# Altium schematic sheet 平衡车双声20717.SchDoc
size A3
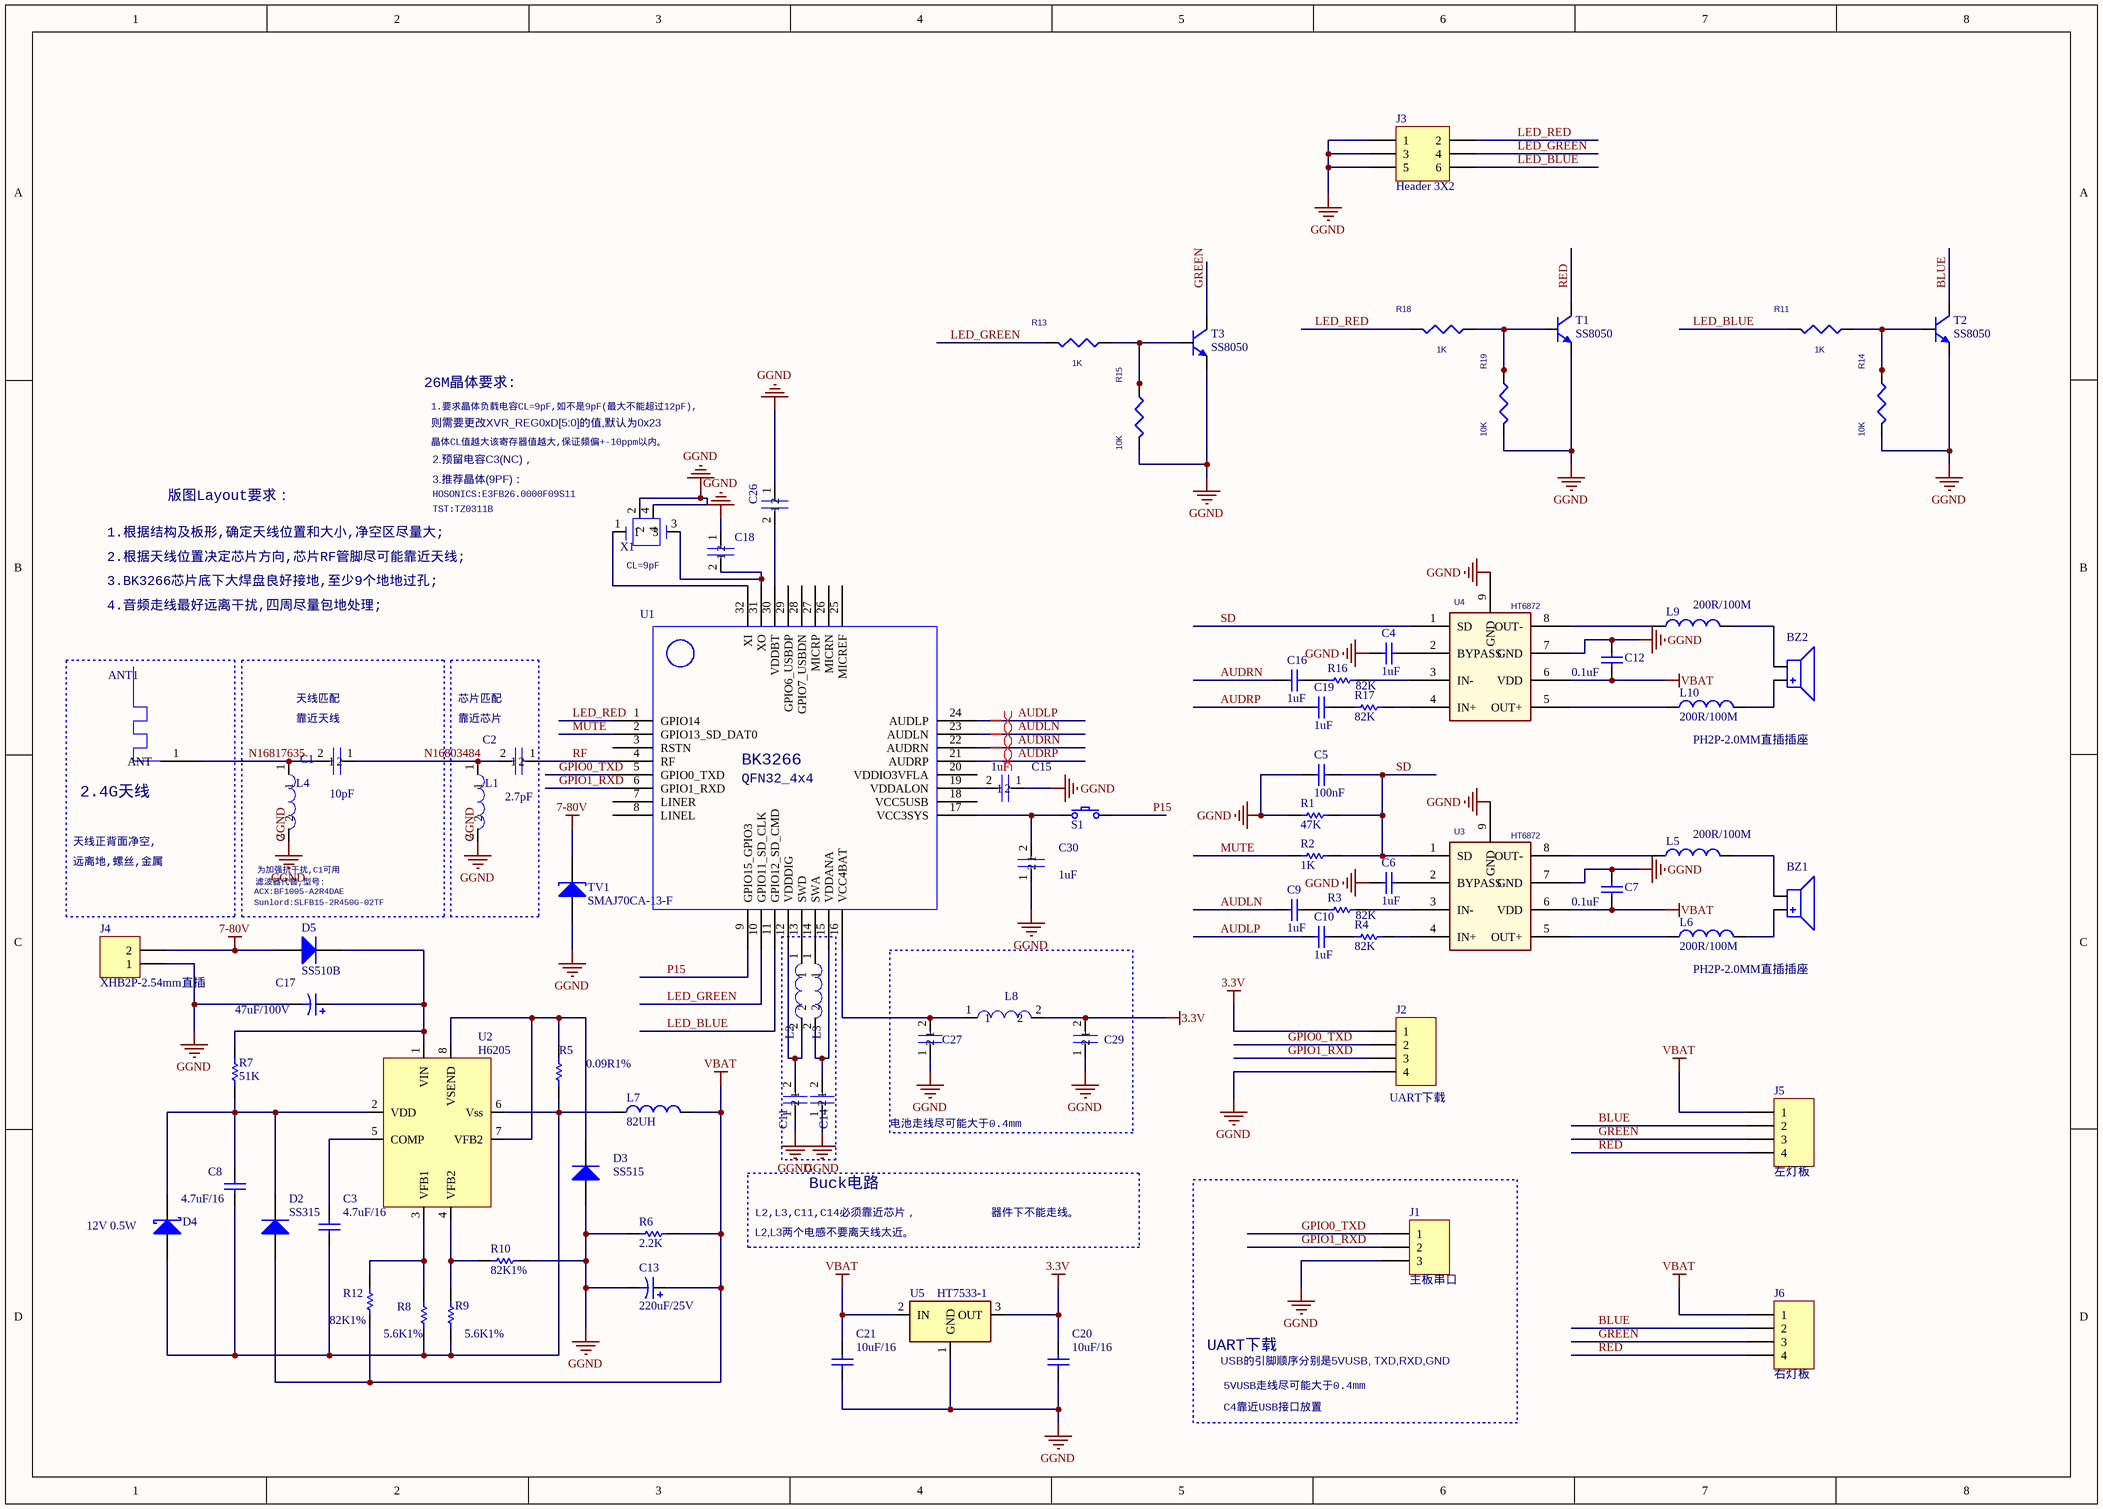
[diagram p0: 平衡车双声20717.SchDoc]

## Parts
ANT1  ANT_2G4  [BT_NAMI_2]  (value not drawn)
BZ1  PH2P-2.0MM直插插座  [2PIN-2.0]
BZ2  PH2P-2.0MM直插插座  [2PIN-2.0]
C1  10pF  [LC-0603_C]
C2  2.7pF  [LC-0603_C]
C3  4.7uF/16  [LC-0805_C]
C4  1uF  [LC-0603_C]
C5  100nF  [LC-0603_C]
C6  1uF  [LC-0603_C]
C7  0.1uF  [LC-0603_C]
C8  4.7uF/16  [LC-0805_C]
C9  1uF  [LC-0603_C]
C10  1uF  [LC-0603_C]
C11  4.7uF/0603  [LC-0603_C]  (value not drawn)
C12  0.1uF  [LC-0603_C]
C13  220uF/25V  [R3.5/8]
C14  4.7uF/0603  [LC-0603_C]  (value not drawn)
C15  1uF  [LC-0603_C]
C16  1uF  [LC-0603_C]
C17  47uF/100V  [R3.5/8_1]
C18  10pF  [LC-0603_C]  (value not drawn)
C19  1uF  [LC-0603_C]
C20  10uF/16  [LC-0805_C]
C21  10uF/16  [LC-0805_C]
C26  1uF  [LC-0603_C]  (value not drawn)
C27  0.1uF  [LC-0603_C]  (value not drawn)
C29  0.1uF  [LC-0603_C]  (value not drawn)
C30  1uF  [LC-0603_C]
D2  SS315  [DO-214AA]
D3  SS515  [DO-214AA]
D4  12V 0.5W  [LL34/SOD-80]
D5  SS510B  [DO-214AA]
J1  主板串口  [3PIN-2.0]
J2  UART下载  [4P-2.0]
J3  Header 3X2  [3P*2-2.0]
J4  XHB2P-2.54mm直插  [2P-2.5]
J5  左灯板  [4PIN-2.0]
J6  右灯板  [4PIN-2.0]
L1  NC  [LC-0603_L]  (value not drawn)
L2  INDUCTOR_3NH_0603_1  [0805L]  (value not drawn)
L3  INDUCTOR_3NH_0603_1  [0805L]  (value not drawn)
L4  NC  [LC-0603_L]  (value not drawn)
L5  200R/100M  [LC-0603_L]
L6  200R/100M  [LC-0603_L]
L7  82UH  [CD104]
L8  INDUCTOR_3NH_0603_1  [0805L]  (value not drawn)
L9  200R/100M  [LC-0603_L]
L10  200R/100M  [LC-0603_L]
R1  47K  [LC-0603_R]
R2  1K  [LC-0603_R]
R3  82K  [LC-0603_R]
R4  82K  [LC-0603_R]
R5  0.09R1%  [LC-1206_R]
R6  2.2K  [LC-0603_R]
R7  51K  [LC-0603_R]
R8  5.6K1%  [LC-0603_R]
R9  5.6K1%  [LC-0603_R]
R10  82K1%  [LC-0603_R]
R11  1K  [LC-0603_R]
R12  82K1%  [LC-0603_R]
R13  1K  [LC-0603_R]
R14  10K  [LC-0603_R]
R15  10K  [LC-0603_R]
R16  82K  [LC-0603_R]
R17  82K  [LC-0603_R]
R18  1K  [LC-0603_R]
R19  10K  [LC-0603_R]
S1  SW  [KEY_5.2*3.7*6.4]  (value not drawn)
T1  SS8050  [SOT-23-3L]
T2  SS8050  [SOT-23-3L]
T3  SS8050  [SOT-23-3L]
TV1  SMAJ70CA-13-F  [DO-214AA]
U1  BK3266_QFN32_5  [QFN32_4*4*0.4]  (value not drawn)
U2  H6205  [ESOP8]
U3  HT6872  [SOP8-LW]
U4  HT6872  [SOP8-LW]
U5  HT7533-1  [SOT-89-3]
X1  XTAL_16MHZ  [XTAL3225]  (value not drawn)

## Blocks framed on the sheet
2.4G天线: ANT1
电池走线尽可能大于0.4mm: C27 C29 L8
UART下载: J1

## Nets
3.3V: C20.2 C29.2 J2.1 L8.2 U5.3(OUT)
7-80V: D5.1(A) J4.2 TV1.2(K)
GGND: C4.1 C5.1 C6.1 C7.2 C11.1 C12.2 C13.2 C14.1 C15.1 C17.2 C18.1 C20.1 C21.1 C26.1 C27.1 C29.1 C30.1 D3.1(A) J1.3 J2.4 J3.1 J3.3 J3.5 J4.1 L1.2 L4.2 R1.1 R6.2 R10.2 R14.2 R15.2 R19.2 T1.2 T2.2 T3.2 TV1.1(A) U1.33(GGND) U3.7(GND) U3.9(GND) U4.7(GND) U4.9(GND) U5.1(GND) X1.2 X1.4
VBAT: C7.1 C12.1 C13.1 C21.2 D2.1(A) J5.1 J6.1 L7.2 R6.1 R12.1 U3.6(VDD) U4.6(VDD) U5.2(IN)
AUDLN: C9.1 U1.23(AUDLN)
AUDLP: C10.1 U1.24(AUDLP)
AUDRN: C16.1 U1.22(AUDRN)
AUDRP: C19.1 U1.21(AUDRP)
BLUE: J5.2 J6.2 T2.3
GPIO0_TXD: J1.1 J2.2 U1.5(GPIO0_TXD)
GPIO1_RXD: J1.2 J2.3 U1.6(GPIO1_RXD)
GREEN: J5.3 J6.3 T3.3
LED_BLUE: J3.6 R11.2 U1.11(GPIO12_SD_CMD)
LED_GREEN: J3.4 R13.2 U1.10(GPIO11_SD_CLK)
LED_RED: J3.2 R18.2 U1.1(GPIO14)
MUTE: R2.1 U1.2(GPIO13_SD_DAT0)
N16803484: C1.1 C2.2 L1.1
N16817635: ANT1.1(ANT) C1.2 L4.1
P15: S1.2 U1.9(GPIO15_GPIO3)
RED: J5.4 J6.4 T1.3
RF: C2.1 U1.4(RF)
SD: C5.2 R1.2 R2.2 U3.1(SD) U4.1(SD)
NetBZ1_1: BZ1.1 L6.2
NetBZ1_2: BZ1.2 L5.2
NetBZ2_1: BZ2.1 L10.2
NetBZ2_2: BZ2.2 L9.2
NetC3_1: C3.1 C8.1 D4.1(A) L7.1 R5.1 R8.2 R9.2 U2.6(Vss)
NetC3_2: C3.2 U2.5(COMP)
NetC4_2: C4.2 U4.2(BYPASS)
NetC6_2: C6.2 U3.2(BYPASS)
NetC8_2: C8.2 D2.2(K) D4.2(K) R7.1 U2.2(VDD)
NetC9_2: C9.2 R3.1
NetC10_2: C10.2 R4.1
NetC11_2: C11.2 L2.2 U1.12(VDDDIG)
NetC14_2: C14.2 L3.2 U1.15(VDDANA)
NetC15_2: C15.2 U1.19(VDDALON)
NetC16_2: C16.2 R16.1
NetC17_1: C17.1 D5.2(K) R7.2 U2.1(VIN)
NetC18_2: C18.2 U1.31(XO) X1.3
NetC19_2: C19.2 R17.1
NetC26_2: C26.2 U1.30(VDDBT)
NetC27_2: C27.2 L8.1 U1.16(VCC4BAT)
NetC30_2: C30.2 S1.1 U1.17(VCC3SYS)
NetD3_2: D3.2(K) R5.2 U2.7(VFB2) U2.8(VSEND)
NetL2_1: L2.1 U1.13(SWD)
NetL3_1: L3.1 U1.14(SWA)
NetL5_1: L5.1 U3.8(OUT-)
NetL6_1: L6.1 U3.5(OUT+)
NetL9_1: L9.1 U4.8(OUT-)
NetL10_1: L10.1 U4.5(OUT+)
NetR3_2: R3.2 U3.3(IN-)
NetR4_2: R4.2 U3.4(IN+)
NetR8_1: R8.1 R12.2 U2.3(VFB1)
NetR9_1: R9.1 R10.1 U2.4(VFB2)
NetR11_1: R11.1 R14.1 T2.1
NetR13_1: R13.1 R15.1 T3.1
NetR16_2: R16.2 U4.3(IN-)
NetR17_2: R17.2 U4.4(IN+)
NetR18_1: R18.1 R19.1 T1.1
NetU1_32: U1.32(XI) X1.1

Not connected (* = marked no-connect by the designer): U1 3(RSTN) 7(LINER) 8(LINEL) 18(VCC5USB) 20(VDDIO3VFLA) 25(MICREF) 26(MICRN) 27(MICRP) 28(GPIO7_USBDN) 29(GPIO6_USBDP)

## Layout directives
differential pair: AUDLN, AUDLP, AUDRN, AUDRP

## Notes on the sheet
- 26M晶体要求:
- 1.要求晶体负载电容CL=9pF,如不是9pF(最大不能超过12pF),
- 则需要更改XVR_REG0xD[5:0]的值,默认为0x23
- 晶体CL值越大该寄存器值越大,保证频偏+-10ppm以内。
- 版图Layout要求：
- 3.推荐晶体(9PF)：
- HOSONICS:E3FB26.0000F09S11
- TST:TZ0311B
- 2.预留电容C3(NC)，
- 1.根据结构及板形,确定天线位置和大小,净空区尽量大;
- 2.根据天线位置决定芯片方向,芯片RF管脚尽可能靠近天线;
- 3.BK3266芯片底下大焊盘良好接地,至少9个地地过孔;
- (near X1) CL=9pF
- 4.音频走线最好远离干扰,四周尽量包地处理;
- 天线匹配
- 靠近天线
- 芯片匹配
- 靠近芯片
- (near U1) BK3266
- (near U1) QFN32_4x4
- 天线正背面净空,
- 远离地,螺丝,金属
- ACX:BF1005-A2R4DAE
- (near D5) Sunlord:SLFB15-2R450G-02TF
- 滤波器代替,型号:
- (near L4) 为加强抗干扰,C1可用
- Buck电路
- L2,L3,C11,C14必须靠近芯片，
- L2,L3两个电感不要离天线太近。
- 器件下不能走线。
- USB的引脚顺序分别是5VUSB, TXD,RXD,GND
- 5VUSB走线尽可能大于0.4mm
- C4靠近USB接口放置

## Library data of the parts
ANT1 = ANT_2G4: PCB DECAL: PAD1.2CA; Source_Path: E:\LIB\BEKEN_WYF.OLB; Value: ANT_2G4
BZ1 BZ2 = BUZZER
C1 = C0603_1: Manufacturer: AVX; Manufacturer_Part_Number: 0805ZC105KAT2A; PCB DECAL: 0402R; Source_Path: D:\VSS60\PRODUCT DEVELOPMENT\BK3266\BK3266 APPLICATION\DESIGN KIT\WORKING DIRECTORY\V0.1\硬件参考\耳机参考设计_QFN32_4X4\SCH-BK3266_HEADSET_REFERENCE_DESIGN_QFN32_4X4_V1.DSN; Value: 10pF/BPF; APN: C071-0
C2 C15 C26 C30 = C0603_1: Manufacturer: AVX; Manufacturer_Part_Number: 0805ZC105KAT2A; PCB DECAL: 0402R; Source_Path: D:\VSS60\PRODUCT DEVELOPMENT\BK3266\BK3266 APPLICATION\DESIGN KIT\WORKING DIRECTORY\V0.1\硬件参考\耳机参考设计_QFN32_4X4\SCH-BK3266_HEADSET_REFERENCE_DESIGN_QFN32_4X4_V1.DSN; APN: C071-0
  C2: Value: 2.7pF
  C15 C26 C30: Value: 1uF
C3 C8 C20 C21 = Cap: Capacitor; Value: 100pF; Published: 8-Jun-2000; LatestRevisionDate: 17-Jul-2002; LatestRevisionNote: Re-released for DXP Platform.; PackageReference: RAD-0.3; Publisher: Altium Limited
C4 C6 C9 C10 C16 C19 = Cap: Capacitor; Value: 100NF; Published: 8-Jun-2000; LatestRevisionDate: 17-Jul-2002; LatestRevisionNote: Re-released for DXP Platform.; PackageReference: RAD-0.3; Publisher: Altium Limited
C5 = Cap: Capacitor; Published: 8-Jun-2000; LatestRevisionDate: 17-Jul-2002; LatestRevisionNote: Re-released for DXP Platform.; PackageReference: RAD-0.3; Publisher: Altium Limited; Value: 100NF
C7 C12 = Cap: Capacitor; Value: 2.7PF; Published: 8-Jun-2000; LatestRevisionDate: 17-Jul-2002; LatestRevisionNote: Re-released for DXP Platform.; PackageReference: RAD-0.3; Publisher: Altium Limited
C11 C14 = AVX__1.01_UF_0603: Manufacturer: AVX; Manufacturer_Part_Number: 06035C103KAt2A; PCB DECAL: 0402R; Source_Path: D:\VSS60\PRODUCT DEVELOPMENT\BK3266\BK3266 APPLICATION\DESIGN KIT\WORKING DIRECTORY\V0.1\硬件参考\耳机参考设计_QFN32_4X4\SCH-BK3266_HEADSET_REFERENCE_DESIGN_QFN32_4X4_V1.DSN; Value: 2.2uF; APN: C006-0
C13 C17 = Cap Pol1: Polarized Capacitor (Radial); Value: 100pF; Published: 8-Jun-2000; LatestRevisionDate: 17-Jul-2002; LatestRevisionNote: Re-released for DXP Platform.; PackageReference: RB7.6-15; Publisher: Altium Limited
C18 = C0603_1: Manufacturer: AVX; Manufacturer_Part_Number: 0805ZC105KAT2A; PCB DECAL: 0402R; Source_Path: D:\VSS60\PRODUCT DEVELOPMENT\BK3266\BK3266 APPLICATION\DESIGN KIT\WORKING DIRECTORY\V0.1\硬件参考\耳机参考设计_QFN32_4X4\SCH-BK3266_HEADSET_REFERENCE_DESIGN_QFN32_4X4_V1.DSN; Value: NC; APN: C071-0
C27 C29 = AVX__1.01_UF_0603: Manufacturer: AVX; Manufacturer_Part_Number: 06035C103KAt2A; PCB DECAL: 0402R; Source_Path: D:\VSS60\PRODUCT DEVELOPMENT\BK3266\BK3266 APPLICATION\DESIGN KIT\WORKING DIRECTORY\V0.1\硬件参考\耳机参考设计_QFN32_4X4\SCH-BK3266_HEADSET_REFERENCE_DESIGN_QFN32_4X4_V1.DSN; Value: 4.7uF; APN: C006-0
D2 D3 D5 = Diode 1N5402: 3 Amp General Purpose Rectifier; Published: 8-Jun-2000; LatestRevisionDate: 17-Jul-2002; LatestRevisionNote: Re-released for DXP Platform.; DatasheetDocument: 1998; PackageDocument: Aug-1999; PackageReference: DO-201AD; Publisher: Altium Limited; ComponentLink1Description: Manufacturer Link; ComponentLink1URL: http://www.fairchildsemi.com/; ComponentLink2Description: Datasheet; ComponentLink2URL: http://www.fairchildsemi.com/ds/1N%2F1N5400.pdf
D4 = D Schottky: Schottky Diode; Published: 8-Jun-2000; LatestRevisionDate: 17-Jul-2002; LatestRevisionNote: Re-released for DXP Platform.; PackageReference: SMB; Publisher: Altium Limited; PackageDescription: DO-214-AA/SMB; 2 C-Bend Leads; Body 5.3 x 3.6 mm, inc. leads (LxW); Code_JEDEC: DO-214-AA
J1 = Header 3: Header, 3-Pin; LatestRevisionDate: 17-Jul-2002; LatestRevisionNote: Re-released for DXP Platform.; Publisher: Altium Limited
J2 J5 J6 = Header 4: Header, 4-Pin; LatestRevisionDate: 17-Jul-2002; LatestRevisionNote: Re-released for DXP Platform.; Publisher: Altium Limited
J3 = Header 3X2: Header, 3-Pin, Dual row; LatestRevisionDate: 17-Jul-2002; LatestRevisionNote: Re-released for DXP Platform.; Publisher: Altium Limited
J4 = Header 2: Header, 2-Pin; LatestRevisionDate: 17-Jul-2002; LatestRevisionNote: Re-released for DXP Platform.; Publisher: Altium Limited
L1 L4 = INDUCTOR_3NH_0603_1: Manufacturer: COILCRAFT; Manufacturer_Part_Number: 0805HS-030TMBC; PCB DECAL: 0402R; Source_Path: D:\VSS60\PRODUCT DEVELOPMENT\BK3266\BK3266 APPLICATION\DESIGN KIT\WORKING DIRECTORY\V0.1\硬件参考\耳机参考设计_QFN32_4X4\SCH-BK3266_HEADSET_REFERENCE_DESIGN_QFN32_4X4_V1.DSN; APN: L035-0; Value: NC
L2 L3 = INDUCTOR_3NH_0603_1: Manufacturer: COILCRAFT; Manufacturer_Part_Number: 0805HS-030TMBC; PCB DECAL: R0603; Source_Path: D:\VSS60\PRODUCT DEVELOPMENT\BK3266\BK3266 APPLICATION\DESIGN KIT\WORKING DIRECTORY\V0.1\硬件参考\耳机参考设计_QFN32_4X4\SCH-BK3266_HEADSET_REFERENCE_DESIGN_QFN32_4X4_V1.DSN; Value: 4.7uH; APN: L035-0
L5-L7 L9 L10 = Inductor: Code_IEC: 1005; Value: 10mH; Published: 8-Jun-2000; LatestRevisionDate: 17-Jul-2002; LatestRevisionNote: Re-released for DXP Platform.; PackageReference: 0402-A; Publisher: Altium Limited; Code_JEITA: 0402
L8 = INDUCTOR_3NH_0603_1: Manufacturer: COILCRAFT; Manufacturer_Part_Number: 0805HS-030TMBC; PCB DECAL: 0402R; Source_Path: D:\VSS60\PRODUCT DEVELOPMENT\BK3266\BK3266 APPLICATION\DESIGN KIT\WORKING DIRECTORY\V0.1\硬件参考\耳机参考设计_QFN32_4X4\SCH-BK3266_HEADSET_REFERENCE_DESIGN_QFN32_4X4_V1.DSN; Value: NC; APN: L035-0
R1 R3-R10 R12 R16 R17 = Res1: Resistor; Value: 1K; Published: 8-Jun-2000; LatestRevisionDate: 17-Jul-2002; LatestRevisionNote: Re-released for DXP Platform.; PackageReference: AXIAL-0.3; Publisher: Altium Limited
R2 = Res1: Resistor; Published: 8-Jun-2000; LatestRevisionDate: 17-Jul-2002; LatestRevisionNote: Re-released for DXP Platform.; PackageReference: AXIAL-0.3; Publisher: Altium Limited; Value: 1K
R11 R13-R15 R18 R19 = R_Dup1
S1 = SW: Switch
T1-T3 = NPN_BJT: Bipolar Junction Transistor
TV1 = D Tunnel1: Tunnel Diode - RLC Model; Published: 8-Jun-2000; LatestRevisionDate: 17-Jul-2002; LatestRevisionNote: Re-released for DXP Platform.; PackageVersion: Feb-2002; PackageReference: 3.2X1.6X1.1; Publisher: Altium Limited; PackageDescription: SM LED; 2 Flat Leads
U1 = BK3266_QFN32_5: PCB DECAL: BK3266_QFN32_4X4; Source_Path: D:\VSS60\PRODUCT DEVELOPMENT\BK3266\BK3266 APPLICATION\DESIGN KIT\WORKING DIRECTORY\V0.1\硬件参考\耳机参考设计_QFN32_4X4\SCH-BK3266_HEADSET_REFERENCE_DESIGN_QFN32_4X4_V1.DSN; Value: BK3266_QFN32
U3 U4 = AM24LC02_0
U5 = XC6206P302M
X1 = XTAL_16MHZ: PCB DECAL: 3225_4; Source_Path: J:\LAB\GLE\LIB\BEKEN-1.OLB; Value: 26MHz